# EasyEDA schematic SmartDevice_2020-07-31_15-30-18.json
TITLE: ESP-32S; REV: 1.0; Date: 2020-07-01; Sheet: 1/1; Drawn By: Donut; Company: Walailak
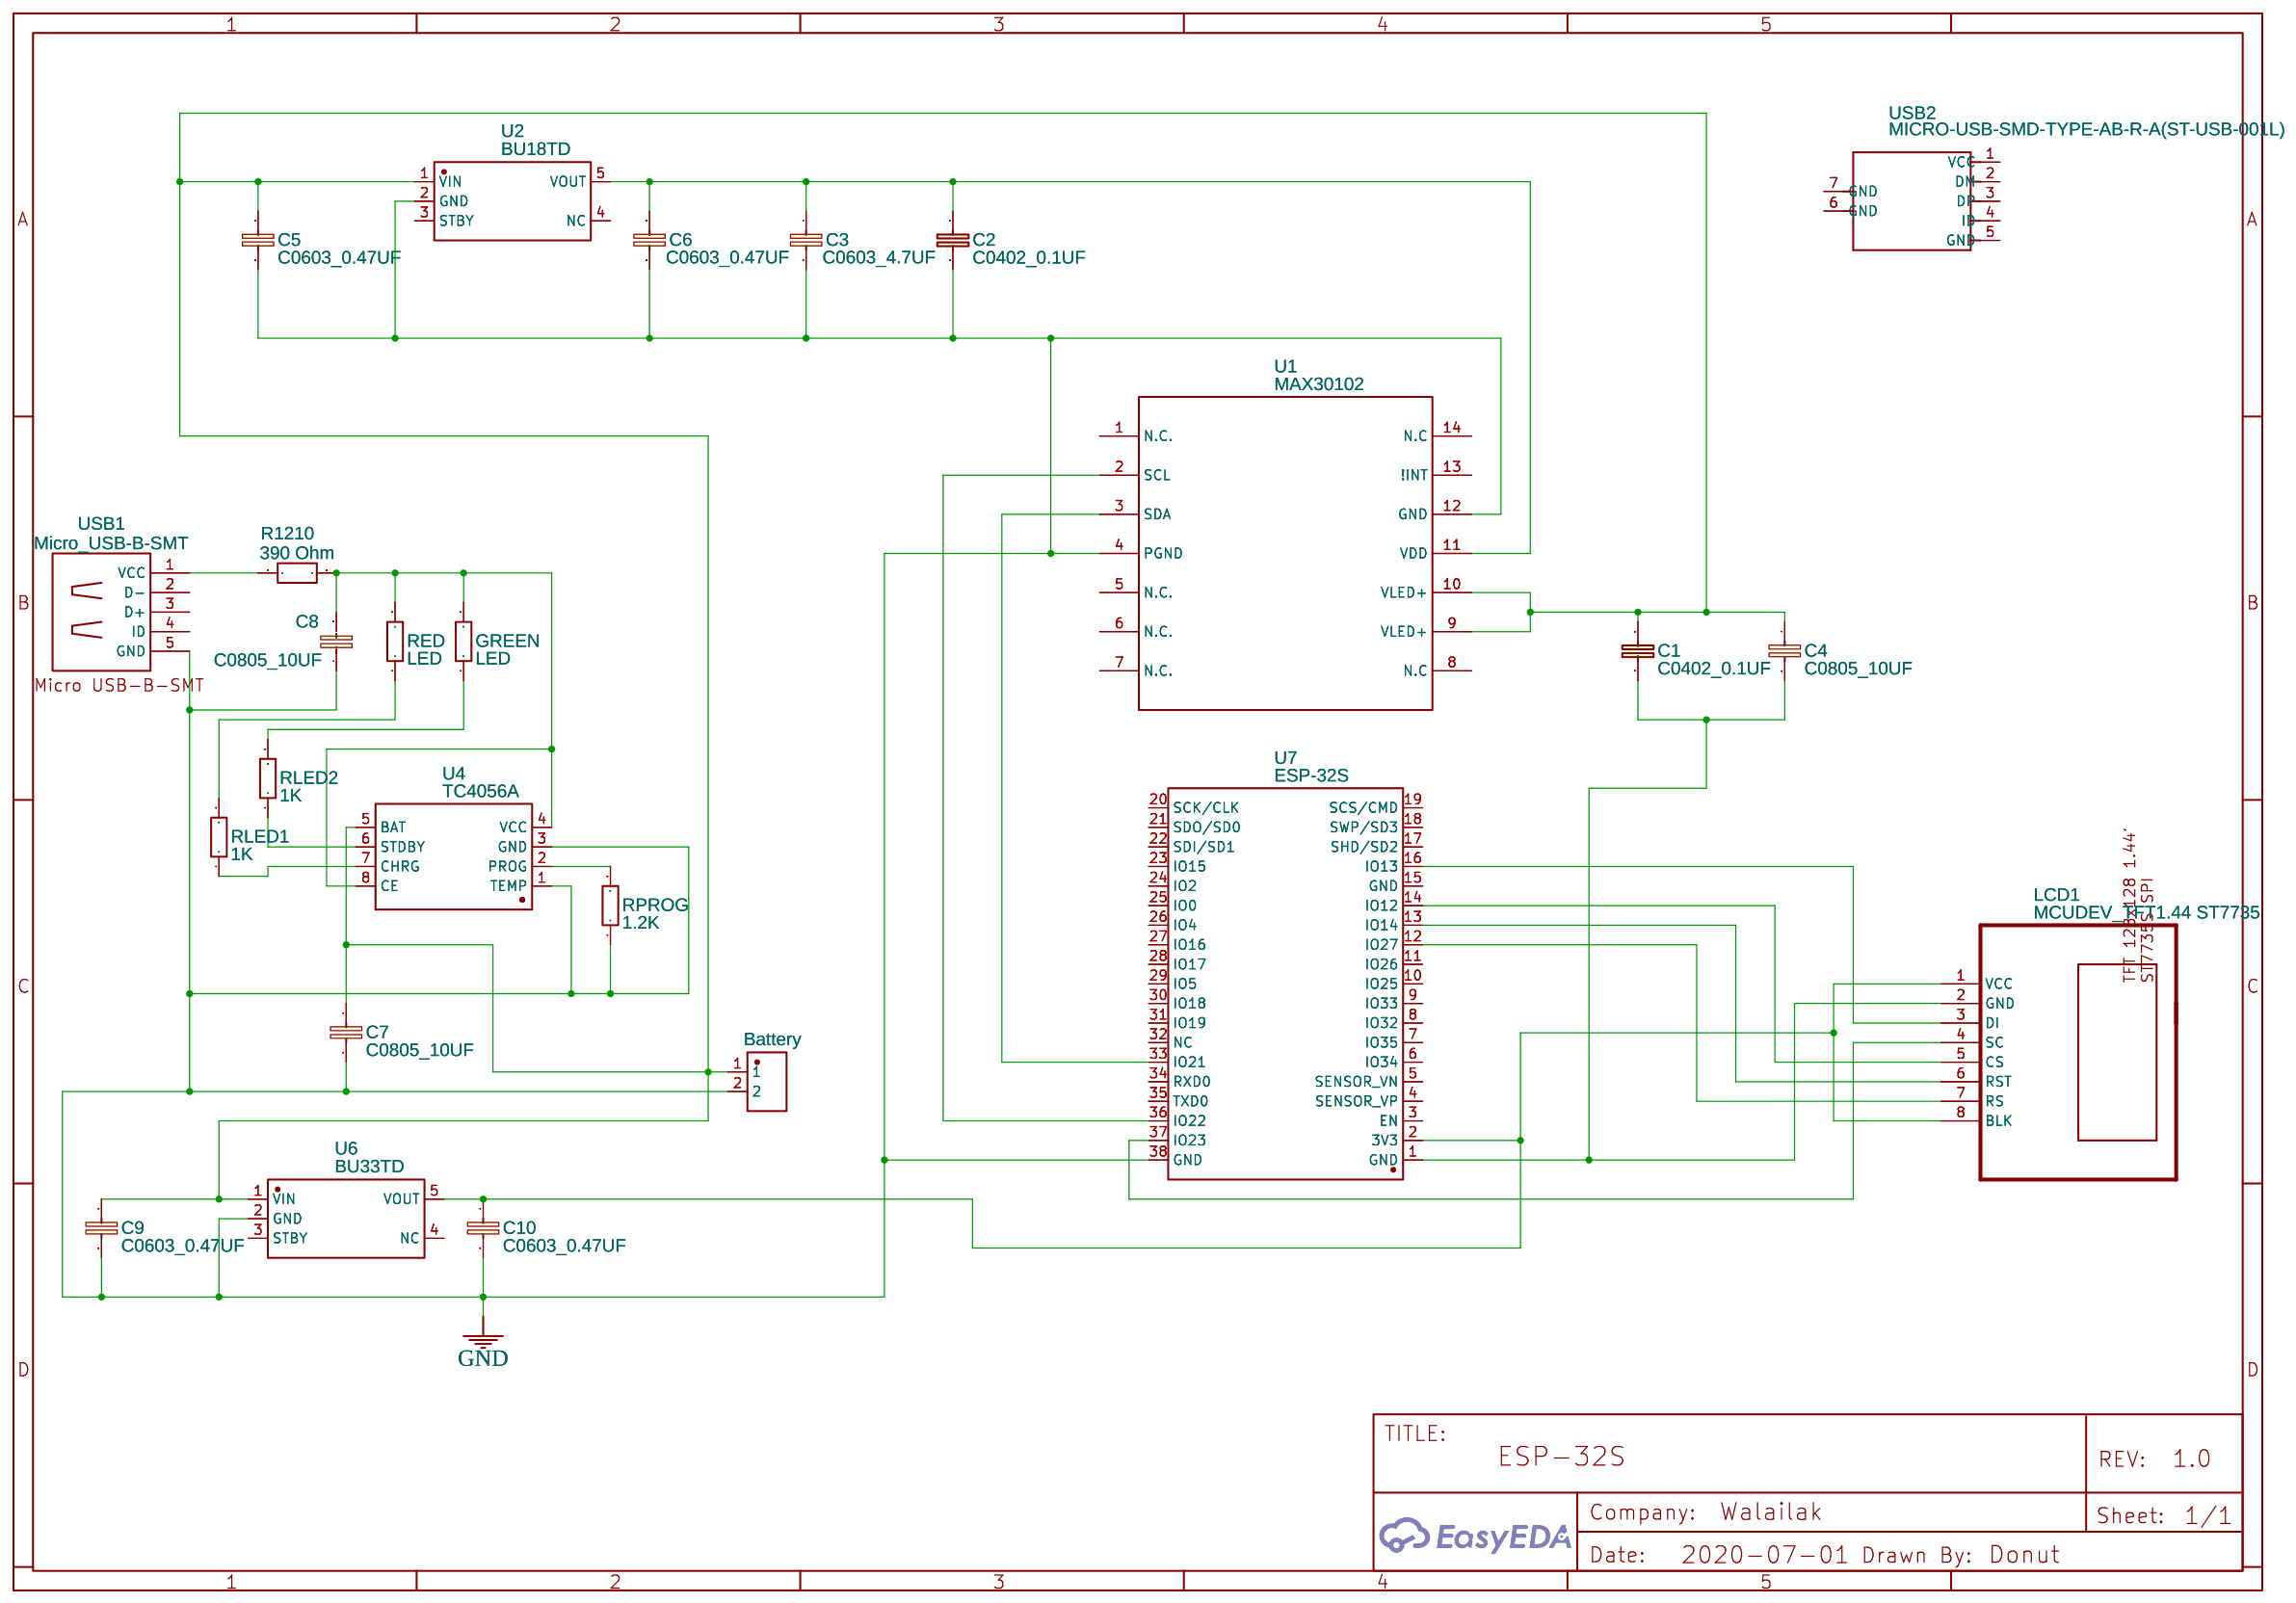
[diagram p0: schematic sheet]

## Parts
C1  C0402_0.1UF  [0402-CAP]
C2  C0402_0.1UF  [0402-CAP]
C3  C0603_4.7UF  [C0603]
C4  C0805_10UF  [0805]
C5  C0603_0.47UF  [C0603]
C6  C0603_0.47UF  [C0603]
C7  C0805_10UF  [0805]
C8  C0805_10UF  [0805]
C9  C0603_0.47UF  [C0603]
C10  C0603_0.47UF  [C0603]
GREEN  LED  [RES-SMD_L3.5-W1.5]
LCD1  MCUDEV_TFT1.44 ST7735  [TFT1,44_SPI_128X128_ST7735S]
R1210  390 Ohm  [R1210]
RED  LED  [RES-SMD_L3.5-W1.5]
RLED1  1K  [RES-SMD_L3.5-W1.5]
RLED2  1K  [RES-SMD_L3.5-W1.5]
RPROG  1.2K  [RES-SMD_L3.5-W1.5]
U1  MAX30102  [OESIP-14]
U2  BU18TD  [SSOP-5]
U3  Battery  [CONN-TH_P5.08_KF127R-5.08-2P]
U4  TC4056A  [SOP-8_150MIL]
U6  BU33TD  [SSOP-5]
U7  ESP-32S  [WIFIM-SMD_ESP-32S]
USB1  Micro_USB-B-SMT  [MICRO_USB-B-SMT]
USB2  MICRO-USB-SMD-TYPE-AB-R-A(ST-USB-001L)  [MICRO-USB5+2P-SMD-0.65]

## Library data of the parts
C1 C2 = 0.1UF-16V(+-10%)(0402): Contributor: SparkFun
C3 C5 C6 C9 C10 = C0603_0.47UF: Contributor: concon
C4 C7 C8 = 10UF-0805-10V-10%: Contributor: Mohamed Abd El Moniem
GREEN RED RLED1 RLED2 RPROG = MELF-MFR02041/4WS41.2KΩFT50: Supplier: LCSC; Supplier Part: C265932; Manufacturer: Thunder Component; Contributor: LCSC
LCD1 = MCUDEV_TFT1.44 ST7735: Supplier: Aliexpress; Contributor: notmyfault; link: https://www.aliexpress.com/item/33016009611.html?spm=a2g0s.9042311.0.0.27424c4dCXaHgF
R1210 = 1210W2F1210T5E: Supplier: LCSC; Supplier Part: C422419; Manufacturer: Uniroyal Elec; Contributor: LCSC
U1 = MAX30102: Manufacturer: MAXIM INTEGRATED PRODUCTS; Manufacturer Part: 92Y9295; Supplier: Element14; Supplier Part: MAX30101EFD+; link: https://mexico.newark.com/maxim-integrated-products/max30101efd/oximeter-heart-rate-sensor-oesip/dp/92Y9295?COM=main-search%20CMPNULL; Contributor: Vanessa_Soto
U2 U6 = SSOP-5_CM_Copy: Supplier: LCSC; Supplier Part: C123010; Manufacturer: ROHM Semicon; Manufacturer Part: BD4825G-TR; Contributor: LCSC
U3 = KF127R-5.08-2P: Supplier: LCSC; Supplier Part: C474910; Manufacturer: Cixi Kefa Elec; Contributor: LCSC
U4 = TC4056A
U7 = ESP-32S: Supplier: LCSC; Supplier Part: C82899; Manufacturer: Ai-Thinker; Contributor: LCSC
USB1 = Micro_USB-B-SMT: Contributor: Guest; Supplier Part: C21377; Supplier: LCSC; link: http://item.szlcsc.com/22094.html
USB2 = MICRO-USB-SMD-TYPE-AB-R-A(ST-USB-001L): Manufacturer Part: ?

## Nets
GND: C2.2 C3.2 C5.2 C6.2 C7.2 C8.1 C9.2 C10.2 RPROG.1 U1.4(PGND) U1.12(GND) U2.2(GND) U3.2 U4.1(TEMP) U4.3(GND) U6.2(GND) U7.38(GND) USB1.5(GND)
Net-(C1-1): C1.1 C4.1 C5.1 C7.1 C9.1 U1.9(VLED+) U1.10(VLED+) U2.1(VIN) U3.1 U4.5(BAT) U6.1(VIN)
Net-(C1-2): C1.2 C4.2 LCD1.2(GND) U7.1(GND)
Net-(C2-1): C2.1 C3.1 C6.1 U1.11(VDD) U2.5(VOUT)
Net-(C8-2): C8.2 GREEN.2 R1210.2 RED.2 U4.4(VCC) U4.8(CE)
Net-(C10-1): C10.1 LCD1.1(VCC) LCD1.8(BLK) U6.5(VOUT) U7.2(3V3)
Net-(GREEN-1): GREEN.1 RLED2.2
Net-(LCD1-3): LCD1.3(DI) U7.16(IO13)
Net-(LCD1-4): LCD1.4(SC) U7.37(IO23)
Net-(LCD1-5): LCD1.5(CS) U7.14(IO12)
Net-(LCD1-6): LCD1.6(RST) U7.13(IO14)
Net-(LCD1-7): LCD1.7(RS) U7.12(IO27)
Net-(R1210-1): R1210.1 USB1.1(VCC)
Net-(RED-1): RED.1 RLED1.2
Net-(RLED1-1): RLED1.1 U4.7(CHRG)
Net-(RLED2-1): RLED2.1 U4.6(STDBY)
Net-(RPROG-2): RPROG.2 U4.2(PROG)
Net-(U1-2): U1.2(SCL) U7.36(IO22)
Net-(U1-3): U1.3(SDA) U7.33(IO21)

Not connected (* = marked no-connect by the designer): U1 1(N.C.) 5(N.C.) 6(N.C.) 7(N.C.) 8(N.C) 13(!INT) 14(N.C); U2 3(STBY) 4(NC); U6 3(STBY) 4(NC); U7 3(EN) 4(SENSOR_VP) 5(SENSOR_VN) 6(IO34) 7(IO35) 8(IO32) 9(IO33) 10(IO25) 11(IO26) 15(GND) 17(SHD/SD2) 18(SWP/SD3) 19(SCS/CMD) 20(SCK/CLK) 21(SDO/SD0) 22(SDI/SD1) 23(IO15) 24(IO2) 25(IO0) 26(IO4) 27(IO16) 28(IO17) 29(IO5) 30(IO18) 31(IO19) 32(NC) 34(RXD0) 35(TXD0); USB1 2(D-) 3(D+) 4(ID); USB2 1(VCC) 2(DM) 3(DP) 4(ID) 5(GND) 6(GND) 7(GND)
